# Altium schematic sheet Communication.SchDoc
size A4; SheetNumber: 12; SheetTotal: 13
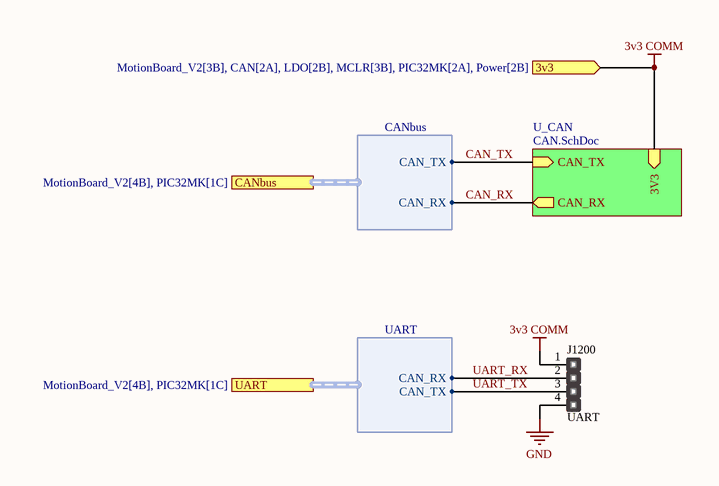
[diagram p0: Communication.SchDoc]

## Parts
J1200  UART  [HM1X4]

## Sub-sheets
U_CAN = CAN.SchDoc: CAN_TX (in), CAN_RX (out), 3V3 (in)

## Ports
3v3 (in, see MotionBoard_V2[3B], CAN[2A], LDO[2B], MCLR[3B], PIC32MK[2A], Power[2B]), CANbus (harness CANbus, see MotionBoard_V2[4B], PIC32MK[1C]), UART (harness UART, see MotionBoard_V2[4B], PIC32MK[1C])

## Harnesses
UART: CAN_RX, CAN_TX
CANbus: CAN_RX, CAN_TX

## Nets
3v3 COMM: J1200.1 ; port 3v3, sheet U_CAN/3V3
GND: J1200.4
CAN_RX: sheet U_CAN/CAN_RX, port CANbus.CAN_RX
CAN_TX: sheet U_CAN/CAN_TX, port CANbus.CAN_TX
UART_RX: J1200.2 ; port UART.CAN_RX
UART_TX: J1200.3 ; port UART.CAN_TX

## Library data of the parts
J1200 = HEADER_1x4